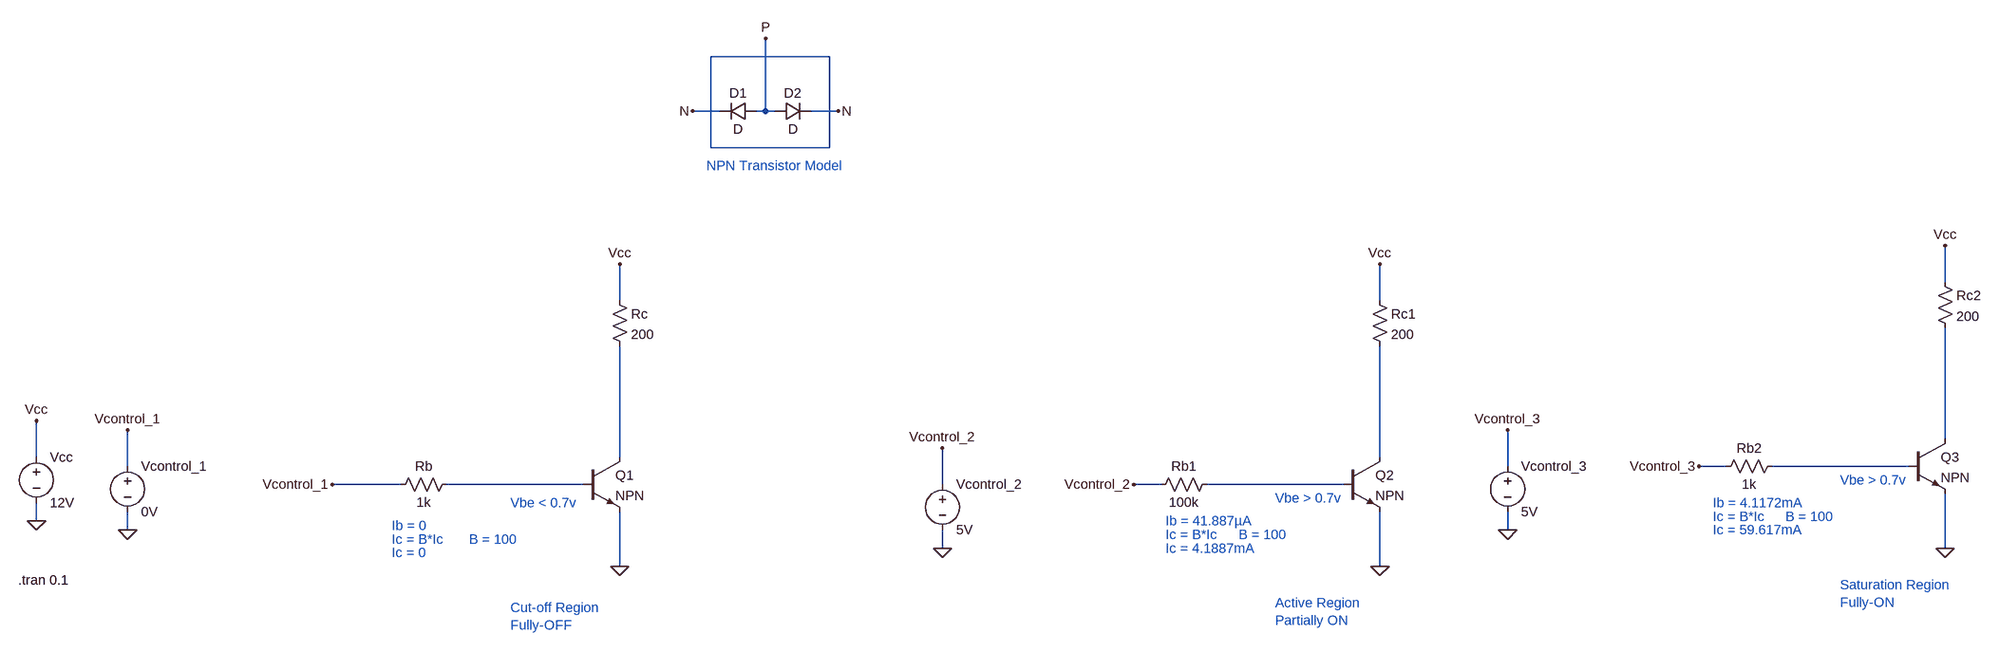
[diagram p0: schematic NPN Transistor.asc]
NPN Transistor.asc, the LTspice schematic file:
Version 4.1
SHEET 1 3268 680
WIRE 768 -672 560 -672
WIRE 576 -576 528 -576
WIRE 656 -576 656 -704
WIRE 656 -576 640 -576
WIRE 672 -576 656 -576
WIRE 784 -576 736 -576
WIRE 560 -512 560 -672
WIRE 768 -512 768 -672
WIRE 768 -512 560 -512
WIRE 3040 -192 3040 -256
WIRE 400 -160 400 -224
WIRE 1776 -160 1776 -224
WIRE 3040 112 3040 -112
WIRE -704 144 -704 80
WIRE 400 144 400 -80
WIRE 1776 144 1776 -80
WIRE -544 160 -544 96
WIRE 2272 160 2272 96
WIRE 2656 160 2608 160
WIRE 2976 160 2736 160
WIRE 16 192 -160 192
WIRE 336 192 96 192
WIRE 1008 192 1008 128
WIRE 1392 192 1344 192
WIRE 1712 192 1472 192
WIRE -704 256 -704 224
WIRE -544 272 -544 240
WIRE 2272 272 2272 240
WIRE 1008 304 1008 272
WIRE 3040 304 3040 208
WIRE 400 336 400 240
WIRE 1776 336 1776 240
FLAG 400 336 0
FLAG -160 192 Vcontrol_1
FLAG 400 -224 Vcc
FLAG -704 256 0
FLAG -704 80 Vcc
FLAG -544 272 0
FLAG -544 96 Vcontrol_1
FLAG 1776 336 0
FLAG 1344 192 Vcontrol_2
FLAG 1776 -224 Vcc
FLAG 1008 304 0
FLAG 1008 128 Vcontrol_2
FLAG 3040 304 0
FLAG 2608 160 Vcontrol_3
FLAG 3040 -256 Vcc
FLAG 2272 272 0
FLAG 2272 96 Vcontrol_3
FLAG 528 -576 N
FLAG 784 -576 N
FLAG 656 -704 P
DATAFLAG -64 192 ""
DATAFLAG 256 192 ""
DATAFLAG 400 16 ""
DATAFLAG 400 272 ""
DATAFLAG 1376 192 ""
DATAFLAG 1632 192 ""
DATAFLAG 1776 16 ""
DATAFLAG 1776 272 ""
DATAFLAG 2640 160 ""
DATAFLAG 2896 160 ""
DATAFLAG 3040 -16 ""
DATAFLAG 3040 240 ""
SYMBOL npn 336 144 R0
SYMATTR InstName Q1
SYMBOL res 384 -176 R0
SYMATTR InstName Rc
SYMATTR Value 200
SYMBOL res 112 176 R90
WINDOW 0 0 56 VBottom 2
WINDOW 3 32 56 VTop 2
SYMATTR InstName Rb
SYMATTR Value 1k
SYMBOL voltage -704 128 R0
SYMATTR InstName Vcc
SYMATTR Value 12V
SYMBOL voltage -544 144 R0
WINDOW 123 0 0 Left 0
WINDOW 39 0 0 Left 0
SYMATTR InstName Vcontrol_1
SYMATTR Value 0V
SYMBOL npn 1712 144 R0
SYMATTR InstName Q2
SYMBOL res 1760 -176 R0
SYMATTR InstName Rc1
SYMATTR Value 200
SYMBOL res 1488 176 R90
WINDOW 0 0 56 VBottom 2
WINDOW 3 32 56 VTop 2
SYMATTR InstName Rb1
SYMATTR Value 100k
SYMBOL voltage 1008 176 R0
WINDOW 123 0 0 Left 0
WINDOW 39 0 0 Left 0
SYMATTR InstName Vcontrol_2
SYMATTR Value 5V
SYMBOL npn 2976 112 R0
SYMATTR InstName Q3
SYMBOL res 3024 -208 R0
SYMATTR InstName Rc2
SYMATTR Value 200
SYMBOL res 2752 144 R90
WINDOW 0 0 56 VBottom 2
WINDOW 3 32 56 VTop 2
SYMATTR InstName Rb2
SYMATTR Value 1k
SYMBOL voltage 2272 144 R0
WINDOW 123 0 0 Left 0
WINDOW 39 0 0 Left 0
SYMATTR InstName Vcontrol_3
SYMATTR Value 5V
SYMBOL diode 640 -592 R90
WINDOW 0 0 32 VBottom 2
WINDOW 3 32 32 VTop 2
SYMATTR InstName D1
SYMBOL diode 672 -560 R270
WINDOW 0 32 32 VTop 2
WINDOW 3 0 32 VBottom 2
SYMATTR InstName D2
TEXT -736 360 Left 2 !.tran 0.1
TEXT 208 408 Left 2 ;Cut-off Region\nFully-OFF
TEXT 208 224 Left 2 ;Vbe < 0.7v
TEXT 1592 400 Left 2 ;Active Region\nPartially ON
TEXT 1592 216 Left 2 ;Vbe > 0.7v
TEXT 2856 368 Left 2 ;Saturation Region\nFully-ON
TEXT 2856 184 Left 2 ;Vbe > 0.7v
TEXT 0 264 Left 2 ;Ib = 0
TEXT 0 288 Left 2 ;Ic = B*Ic
TEXT 0 312 Left 2 ;Ic = 0
TEXT 1400 256 Left 2 ;Ib = 41.887µA
TEXT 1400 280 Left 2 ;Ic = B*Ic
TEXT 1400 304 Left 2 ;Ic = 4.1887mA
TEXT 1528 280 Left 2 ;B = 100
TEXT 136 288 Left 2 ;B = 100
TEXT 2632 224 Left 2 ;Ib = 4.1172mA
TEXT 2632 248 Left 2 ;Ic = B*Ic
TEXT 2632 272 Left 2 ;Ic = 59.617mA
TEXT 2760 248 Left 2 ;B = 100
TEXT 552 -480 Left 2 ;NPN Transistor Model

The netlist it stands for:
* NPN Transistor.asc
Q1 N003 N006 0 0 NPN
Rc Vcc N003 200
Rb N006 Vcontrol_1 1k
Vcc Vcc 0 12V
Vcontrol_1 Vcontrol_1 0 0V
Q2 N004 N007 0 0 NPN
Rc1 Vcc N004 200
Rb1 N007 Vcontrol_2 100k
Vcontrol_2 Vcontrol_2 0 5V
Q3 N002 N005 0 0 NPN
Rc2 Vcc N002 200
Rb2 N005 Vcontrol_3 1k
Vcontrol_3 Vcontrol_3 0 5V
D1 P N D
D2 P N D
.model D D
.lib standard.dio
.model NPN NPN
.model PNP PNP
.lib standard.bjt
.tran 0.1
* Cut-off Region
* Fully-OFF
* Vbe < 0.7v
* Active Region
* Partially ON
* Vbe > 0.7v
* Saturation Region
* Fully-ON
* Vbe > 0.7v
* Ib = 0
* Ic = B*Ic
* Ic = 0
* Ib = 41.887µA
* Ic = B*Ic
* Ic = 4.1887mA
* B = 100
* B = 100
* Ib = 4.1172mA
* Ic = B*Ic
* Ic = 59.617mA
* B = 100
* NPN Transistor Model
.backanno
.end